# EAGLE design BT111_v1 (EAGLE 6.4)
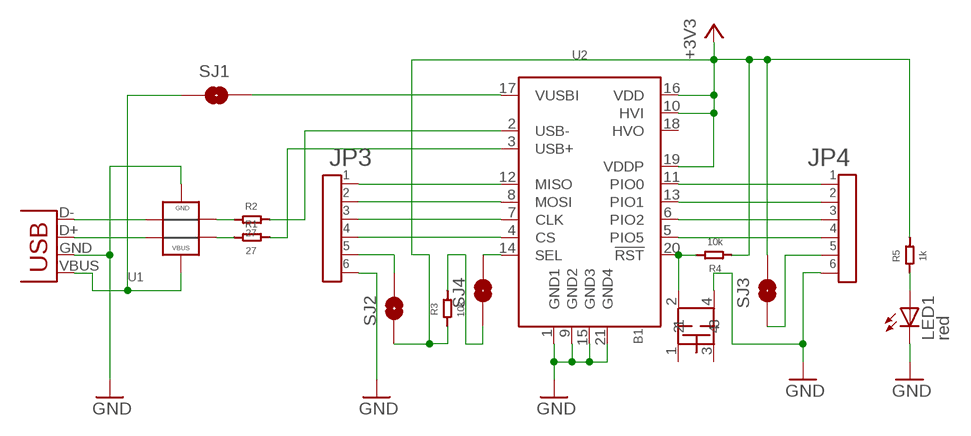
[diagram p0: schematic, sheet 1]

## Parts
B1  BUTTON_ALPS_5.2MM_SMD  [BUTTON_ALPS_SMD_5.2MM_SKQG]
JP1  USB-A-H  [USB-A-H]
JP3  PIN1X6PTH_SMALL  [PIN_1X6_S]
JP4  PIN1X6PTH_SMALL  [PIN_1X6_S]
LED1  red  LEDCHIP-LED0805  [CHIP-LED0805]
R1  27  RESISTOR0603  [0603]
R2  27  RESISTOR0603  [0603]
R3  10k  RESISTOR0603  [0603]
R4  10k  RESISTOR0603  [0603]
R5  1k  RESISTOR0603  [0603]
SJ1  USBPOW  SOLDERJUMPERNC  [SJ_2S]
SJ2  SPIPOW  SOLDERJUMPERNO  [SJ_2S-NO]
SJ3  PIOPOW  SOLDERJUMPERNO  [SJ_2S-NO]
SJ4  PCMSEL  SOLDERJUMPERNO  [SJ_2S-NO]
U1  ST_USBLC6-2  [SOT-23-6L]
U2  BT111  [BT111]

## Nets
+3V3: R3.1 R4.1 R5.2 SJ2.1 SJ3.2 U2.10(HVI) U2.16(VDD) U2.19(VDDP)
CLK: JP3.3 U2.7(CLK)
CS: JP3.4 U2.4(CS)
GND: B1.4 JP1.GND(VBUS) JP3.6 JP4.6 LED1.C U1.2(GND) U2.1(GND1) U2.9(GND2) U2.15(GND3) U2.21(GND4)
MISO: JP3.1 U2.12(MISO)
MOSI: JP3.2 U2.8(MOSI)
N$1: LED1.A R5.1
N$2: JP3.5 SJ2.2
N$4: JP4.5 SJ3.1
N$8: JP1.D-(D+) U1.3(IO2A)
N$10: JP1.D+(D-) U1.1(IO1A)
N$11: R2.1 U1.4(IO2B)
N$12: R1.1 U1.6(IO1B)
PIO0: JP4.1 U2.11(PIO0)
PIO1: JP4.2 U2.13(PIO1)
PIO2: JP4.3 U2.6(PIO2)
PIO5: JP4.4 U2.5(PIO5)
RST: B1.2 R4.2 U2.20(!RST)
SEL: SJ4.2 U2.14(SEL)
SEL2: R3.2 SJ4.1
USB+: R1.2 U2.3(USB+)
USB-: R2.2 U2.2(USB-)
VBUS1: JP1.VBUS(GND) SJ1.1 U1.5(VBUS)
VUSBINT: SJ1.2 U2.17(VUSBI)
Unconnected: B1.1 B1.3 U2.18(HVO)

## Library data of the parts
B1 = 01jyd:BUTTON_ALPS_5.2MM_SMD
JP1 = SparkFun-Connectors:USB: USB Connectors USB-B-PTH is fully proven SKU : PRT-00139/CONN-08278 USB-miniB is fully proven SKU : PRT-00587 USB-A-PCB is untested. USB-A-H is throughly reviewed, but untested. Spark Fun Electronics SKU : PRT-00437 USB-B-SMT is throughly reviewed, but untested. Needs silkscreen touching up. USB-A-S has not been used/tested USB-MB-H has not been used/tested USB-MICROB has been used. CONN-09505
JP3 JP4 = 01jyd:PIN1X6
LED1 = led:LED: LED OSRAM: - CHIPLED LG R971, LG N971, LY N971, LG Q971, LY Q971, LO R971, LY R971 LH N974, LH R974 LS Q976, LO Q976, LY Q976 LO Q996 - Hyper CHIPLED LW Q18S LB Q993, LB Q99A, LB R99A - SideLED LS A670, LO A670, LY A670, LG A670, LP A670 LB A673, LV A673, LT A673, LW A673 LH A674 LY A675 LS A676, LA A676, LO A676, LY A676, LW A676 LS A679, LY A679, LG A679 - Hyper Micro SIDELED® LS Y876, LA Y876, LO Y876, LY Y876 LT Y87S - SmartLED LW L88C, LW L88S LB L89C, LB L89S, LG L890 LS L89K, LO L89K, LY L89K LS L896, LA L896, LO L896, LY L896 - TOPLED LS T670, LO T670, LY T670, LG T670, LP T670 LSG T670, LSP T670, LSY T670, LOP T670, LYG T670 LG T671, LOG T671, LSG T671 LB T673, LV T673, LT T673, LW T673 LH T674 LS T676, LA T676, LO T676, LY T676, LB T676, LH T676, LSB T676, LW T676 LB T67C, LV T67C, LT T67C, LS T67K, LO T67K, LY T67K, LW E67C LS E67B, LA E67B, LO E67B, LY E67B, LB E67C, LV E67C, LT E67C LW T67C LS T679, LY T679, LG T679 LS T770, LO T770, LY T770, LG T770, LP T770 LB T773, LV T773, LT T773, LW T773 LH T774 LS E675, LA E675, LY E675, LS T675 LS T776, LA T776, LO T776, LY T776, LB T776 LHGB T686 LT T68C, LB T68C - Hyper Mini TOPLED® LB M676 - Mini TOPLED Santana® LG M470 LS M47K, LO M47K, LY M47K Source: http://www.osram.convergy.de LUXEON: - LUMILED® LXK2-PW12-R00, LXK2-PW12-S00, LXK2-PW14-U00, LXK2-PW14-V00 LXK2-PM12-R00, LXK2-PM12-S00, LXK2-PM14-U00 LXK2-PE12-Q00, LXK2-PE12-R00, LXK2-PE12-S00, LXK2-PE14-T00, LXK2-PE14-U00 LXK2-PB12-K00, LXK2-PB12-L00, LXK2-PB12-M00, LXK2-PB14-N00, LXK2-PB14-P00, LXK2-PB14-Q00 LXK2-PR12-L00, LXK2-PR12-M00, LXK2-PR14-Q00, LXK2-PR14-R00 LXK2-PD12-Q00, LXK2-PD12-R00, LXK2-PD12-S00 LXK2-PH12-R00, LXK2-PH12-S00 LXK2-PL12-P00, LXK2-PL12-Q00, LXK2-PL12-R00 Source: www.luxeon.com KINGBRIGHT: KA-3528ASYC Source: www.kingbright.com
R1-R5 = 01jyd:RESISTOR
SJ1-SJ4 = SparkFun-Passives:SOLDERJUMPER: Solder Jumper Standard SMD solder jumper. Used to automate production. Two varients : Normally Open and Normally Closed are the same, but have different paste layers. NC will have a large amount of paste and should jumper during reflow.
U1 = 01jyd:ST_USBLC6-2
U2 = 01jyd:BT111

## Board
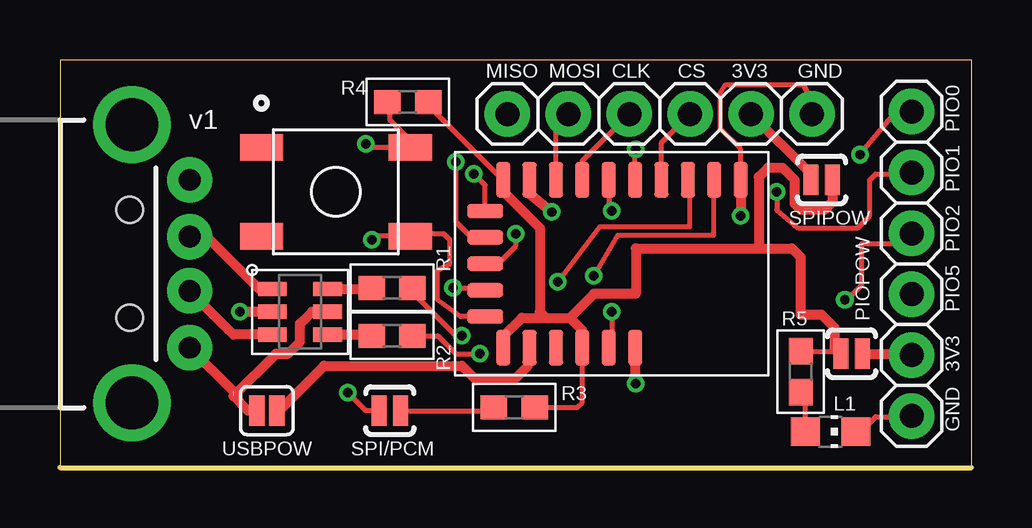
[diagram p1: board, top side]
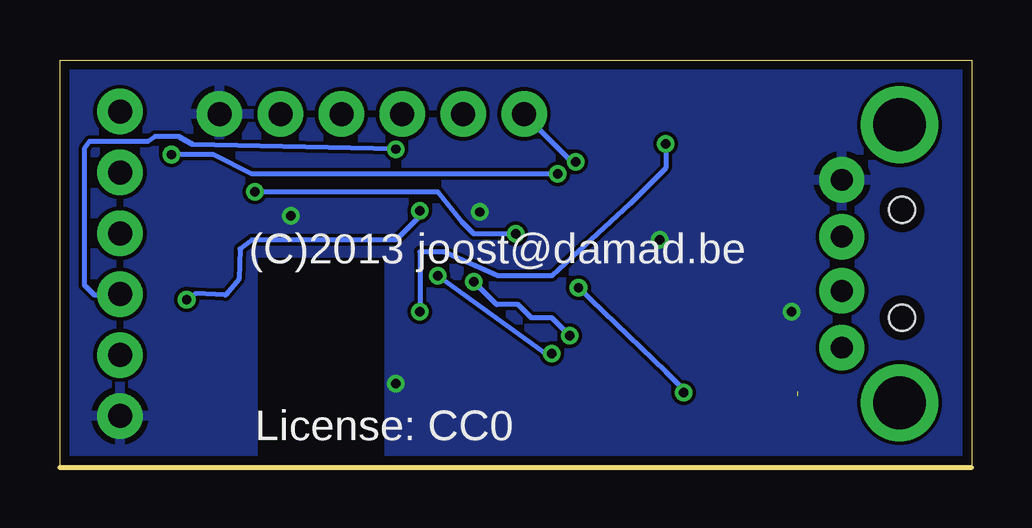
[diagram p2: board, bottom side, seen from below]

Size 38 x 17 mm. Coordinates in mm from the lower left corner, seen from the top.
Outline: 0,0 38,0 38,17 0,17 0,0
Copper layers (1*16): Top 0.0356mm / dielectric 1.5011mm / Bottom 0.0356mm
Design rules "LaenPCBOrder *": minimum track width 6mil, minimum drill 13mil, track to track 6mil, track to pad 6mil, pad to pad 6mil, via to via 6mil, smd to smd 6mil, copper to edge 15mil, drill to drill 6mil, minimum pad ring 7mil, minimum via ring 7mil, stop-mask expansion 4mil, vias tented up to drill 16mil, thermal gap 10mil
bRestrict: area 24.5,0.2 to 29.8,8.8

### Footprints (pad centres in the part's own frame; a part is rotated, then mirrored left to right if it is on the bottom)
BUTTON_ALPS_SMD_5.2MM_SKQG = smd 1.8 x 1.1: 1 -3.1,1.85; 2 3.1,1.85; 3 -3.1,-1.85; 4 3.1,-1.85
USB-A-H = drill 0.914 pad 1.88: D+ 2.4,1.127; D- 2.4,-1.127; GND 2.4,3.5; VBUS 2.4,-3.5 | drill 2.2: GND2 0,-5.8; GND3 0,5.8 | hole 1.1: -0.1,2.25; -0.1,-2.25
PIN_1X6_S = drill 1 pad 1.906: 1 0,6.35; 2 0,3.81; 3 0,1.27; 4 0,-1.27; 5 0,-3.81; 6 0,-6.35
CHIP-LED0805 = smd 1.2 x 1.2: A 0,-1.05; C 0,1.05
0603 = smd 1.1 x 1: 1 -0.85,0; 2 0.85,0
SJ_2S = smd 0.635 x 1.27: 1 -0.412,0; 2 0.412,0
SJ_2S-NO = smd 0.635 x 1.27: 1 -0.45,0; 2 0.45,0
SOT-23-6L = smd 1.2 x 0.6: 1 -1.15,0.95; 2 -1.15,0; 3 -1.15,-0.95; 4 1.15,-0.95; 5 1.15,0; 6 1.15,0.95
BT111 = smd 1.5 x 0.6: 1 -3.5,5.375; 2 -3.5,4.275; 3 -3.5,3.175; 4 -3.5,2.075; 5 -3.5,0.975; 6 -3.5,-0.125; 7 -3.5,-1.225; 8 -3.5,-2.325; 9 -3.5,-3.425; 10 -3.5,-4.525; 16 3.5,-4.525; 17 3.5,-3.425; 18 3.5,-2.325; 19 3.5,-1.225; 20 3.5,-0.125; 21 3.5,0.975 | smd 0.6 x 1.5: 11 -2.2,-5.275; 12 -1.1,-5.275; 13 0,-5.275; 14 1.1,-5.275; 15 2.2,-5.275

### Placement (x,y rotation side)
B1  11.5,11.5 0 top
JP1  3,8.5 0 top
JP3  25,14.75 90 top
JP4  35.5,8.5 0 top
LED1  32.12,1.5 270 top
R1  13.84,7.5 0 top
R2  13.84,5.5 0 top
R3  18.94,2.51 180 top
R4  14.5,15.25 180 top
R5  30.88,4 90 top
SJ1  8.62,2.38 0 top
SJ2  31.75,12 180 top
SJ3  33,4.75 180 top
SJ4  13.75,2.38 180 top
U1  10,6.5 0 top
U2  23,8.5 270 top

### Tracks (layer width: path | path; a pad name or v marks a point on that pad's centre or on a via)
+3V3
  Top 0.203: R3.1 21.56,2.51 21.77,2.73 U2.19 21.77,5.72 21.25,6.25 | R4.1 15.35,15.12 U2.10 | R5.2 32.45,4.85 SJ3.2 32.5,4.75 32.3,4.95
  Top 0.406: U2.16 18.48,5.47 19.25,6.25 20.25,6.25 | 20.25,6.25 21.25,6.25 | 21.25,6.25 21.75,5.75 21.75,5.03 U2.19 | U2.10 18.5,11.97 18.5,11.5 20,10 20,6.5 20.25,6.25 | 29.12,9.14 24,9.14 24,7.25 22.25,7.25 21.25,6.25 | 29.12,9.14 30.5,9.14 30.88,8.76 30.88,6.38 31.75,6.38 32.3,5.83 32.3,4.95 | SJ2.1 32.2,11.07 31.88,10.75 30.88,10.75 30.62,11 30.62,12 30.12,12.5 29.5,12.5 29.12,12.12 29.12,9.14
CLK
  Top 0.203: U2.7 21.77,12.79 JP3.3
CS
  Top 0.203: U2.4 25.07,13.55 JP3.4
GND  (via drill 0.38)
  Top 0.203: v13,9.5 arc-90 13.15,9.65 B1.4 14.7,9.75 16,9.75 16.25,9.5 16.25,8.5 15.75,8.25 15.75,7 16.7,6.3 U2.15 18.05,6.3 | U2.9 19.57,11.43 | U2.1 28.38,13.27 27.53,14.11 27.53,15.64 27.74,15.97 30.99,15.97 31.19,15.54 31.19,14.91 JP3.6 | LED1.C 33.38,1.5 34,2.12 35.48,2.12 JP4.6
  Top 0.406: U1.2 v7.5,6.5 | U2.21 23.98,3.52 v24,3.5 | 19.57,11.43 v20.5,10.66 | U2.1 v28.38,10.5
  pour Bottom: 0,17 38,17 38,0 0,0
MISO  (via drill 0.38)
  Top 0.203: U2.12 17.15,9.6 16.5,10.25 v16.5,12.75
  Bottom 0.203: v16.5,12.75 16.65,12.75 JP3.1
MOSI
  Top 0.203: U2.8 20.68,14.23 JP3.2
N$1
  Top 0.203: LED1.A 31.07,2.95 R5.1
N$2
  Top 0.406: 28.81,14.46 JP3.5 31.3,12.26 SJ2.2
N$4
  Top 0.406: 35.42,4.77 JP4.5 35.44,4.75 SJ3.1
N$8
  Top 0.406: U1.3 7.22,5.55 JP1.D-
N$10
  Top 0.406: U1.1 8.3,7.45 6.25,9.5 5.53,9.5 JP1.D+
N$11
  Top 0.406: U1.4 13.1,5.55 arc-90 R2.1
N$12
  Top 0.406: U1.6 13.1,7.45 arc90 R1.1
PIO0  (via drill 0.38)
  Top 0.203: U2.11 17.73,11.78 v17.25,12.25 | v33.35,13.05 34.75,14.75 35.4,14.75 JP4.1
  Bottom 0.203: v17.25,12.25 30,12.25 31.6,13.05 v33.35,13.05
PIO1  (via drill 0.38)
  Top 0.203: U2.13 18.25,8.5 19,9.25 v19,9.75 | v29.88,11.5 29.88,10.75 30.75,10 33.25,10 33.75,10.5 33.75,12 34,12.25 35.44,12.25 JP4.2
  Bottom 0.203: v19,9.75 20.75,9.75 21.25,10.25 22.25,11.5 v29.88,11.5
PIO2  (via drill 0.38)
  Top 0.203: U2.6 22.88,10.88 v23,10.71 | v32.72,7 32.82,7 33.43,7.61 33.43,9.34 35.07,9.34 JP4.3
  Bottom 0.203: v23,10.71 23,10.5 24,9.5 30,9.5 30.5,9.12 30.54,7.88 31.1,7.19 32.35,7.26 v32.72,7
PIO5  (via drill 0.38)
  Top 0.203: U2.5 23.98,13.22 v24,13.28
  Bottom 0.203: v24,13.28 32.5,13.48 | 32.5,13.48 33,13.75 | 32.5,13.48 32.5,13.52 33.02,13.81 34.04,13.81 34.34,13.6 36.78,13.6 36.98,13.3 36.98,7.61 36.58,7.21 35.52,7.21 JP4.4
RST  (via drill 0.38)
  Top 0.203: R4.2 13.75,15.15 13.75,14.5 14.6,13.65 B1.2 12.9,13.35 v12.75,13.5 | v23,6.5 23,5.12 U2.20
  Bottom 0.203: v23,6.5 23,9 22,9 19.75,8 17.5,8 14.25,11 12.75,12.5 v12.75,13.5
SEL  (via drill 0.38)
  Top 0.203: v16.38,7.5 17.62,7.5 U2.14 | SJ4.2 12.75,2.38 v12,3.12
  Bottom 0.203: v16.38,7.5 12.73,3.98 12,3.25 v12,3.12
SEL2
  Top 0.203: R3.2 arc90 R3.2 17.95,2.38 SJ4.1
USB+  (via drill 0.38)
  Top 0.203: R1.2 14.69,7.31 16.5,5.5 v16.75,5.5 | v20.75,7.75 22.5,10.05 26.25,10.05 26.25,11.93 U2.3
  Bottom 0.203: v16.75,5.5 17.5,6.25 18.35,6.25 18.9,6.8 19.8,6.8 v20.75,7.75
USB-  (via drill 0.38)
  Top 0.203: R2.2 15.75,5.5 16.5,4.75 v17.5,4.75 | v22.25,8 23.25,9.7 27.25,9.7 27.25,11.97 U2.2
  Bottom 0.203: v17.5,4.75 17.75,4.75 v22.25,8
VBUS1  (1 unrouted)
  Top 0.406: 7.23,3.17 JP1.VBUS | U1.5 10.5,6.5 10,6 10,5.25 9.5,4.75 9,4.75 7.23,2.98 7.83,2.38 SJ1.1
VUSBINT
  Top 0.406: U2.17 19.5,4.92 19.5,4.25 19,3.75 17.25,3.75 16.75,4.25 11,4.25 9.12,2.38 SJ1.2

### Text on the board
tPlace: MISO | MOSI | CLK | CS | 3V3 | GND | v1 | PIO0 | PIO1 | SPIPOW | PIO2 | PIOPOW | PIO5 | 3V3 | L1 | GND | USBPOW | SPI/PCM
bPlace: (C)2013 joost@damad.be | License: CC0